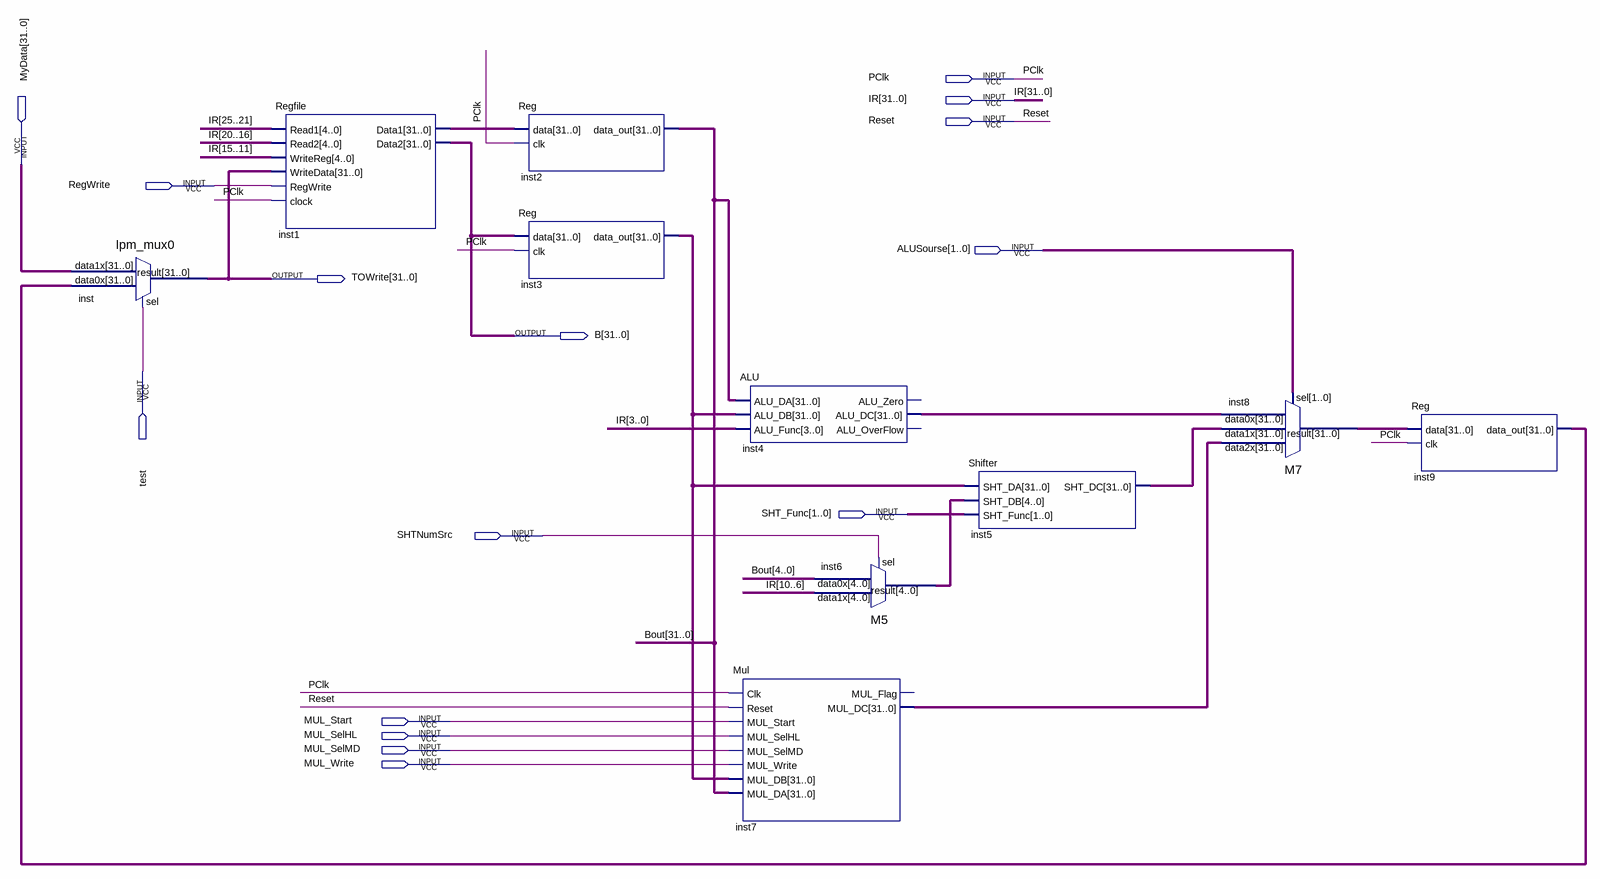
[diagram p0: schematic sheet]
// Quartus schematic R.bdf as structural Verilog: 10 symbols, 15 pins
module R (
  input  PClk,
  input  [31:0] IR,
  input  Reset,
  input  [31:0] MyData,
  input  RegWrite,
  input  [1:0] ALUSourse,
  input  test,
  input  [1:0] SHT_Func,
  input  SHTNumSrc,
  input  MUL_Start,
  input  MUL_SelHL,
  input  MUL_SelMD,
  input  MUL_Write,
  output [31:0] TOWrite,
  output [31:0] B
);

  wire [4:0] inst6_result;
  wire [31:0] Bout, inst1_data1, inst3_data_out, inst4_alu_dc, inst5_sht_dc, inst7_mul_dc, inst8_result,
       inst9_data_out;

  lpm_mux0 inst (.data1x(MyData), .data0x(inst9_data_out), .sel(test), .result(TOWrite));
  Regfile inst1 (
    .Read1(IR[25:21]), .Read2(IR[20:16]), .WriteReg(IR[15:11]), .WriteData(TOWrite), .RegWrite(RegWrite),
    .clock(PClk), .Data1(inst1_data1), .Data2(B));
  Reg inst2 (.data(inst1_data1), .clk(PClk), .data_out(Bout));
  Reg inst3 (.data(B), .clk(PClk), .data_out(inst3_data_out));
  ALU inst4 (
    .ALU_DA(Bout), .ALU_DB(inst3_data_out), .ALU_Func(IR[3:0]), .ALU_DC(inst4_alu_dc));  // open: ALU_Zero, ALU_OverFlow
  Mul inst7 (
    .Clk(PClk), .Reset(Reset), .MUL_Start(MUL_Start), .MUL_SelHL(MUL_SelHL), .MUL_SelMD(MUL_SelMD),
    .MUL_Write(MUL_Write), .MUL_DB(inst3_data_out), .MUL_DA(Bout), .MUL_DC(inst7_mul_dc));  // open: MUL_Flag
  M5 inst6 (.data1x(IR[10:6]), .data0x(Bout[4:0]), .sel(SHTNumSrc), .result(inst6_result));
  Shifter inst5 (.SHT_DA(inst3_data_out), .SHT_DB(inst6_result), .SHT_Func(SHT_Func), .SHT_DC(inst5_sht_dc));
  M7 inst8 (
    .data2x(inst7_mul_dc), .data1x(inst5_sht_dc), .data0x(inst4_alu_dc), .sel(ALUSourse),
    .result(inst8_result));
  Reg inst9 (.data(inst8_result), .clk(PClk), .data_out(inst9_data_out));
endmodule
